# Altium project Gator Stream Receiver.PrjPcb
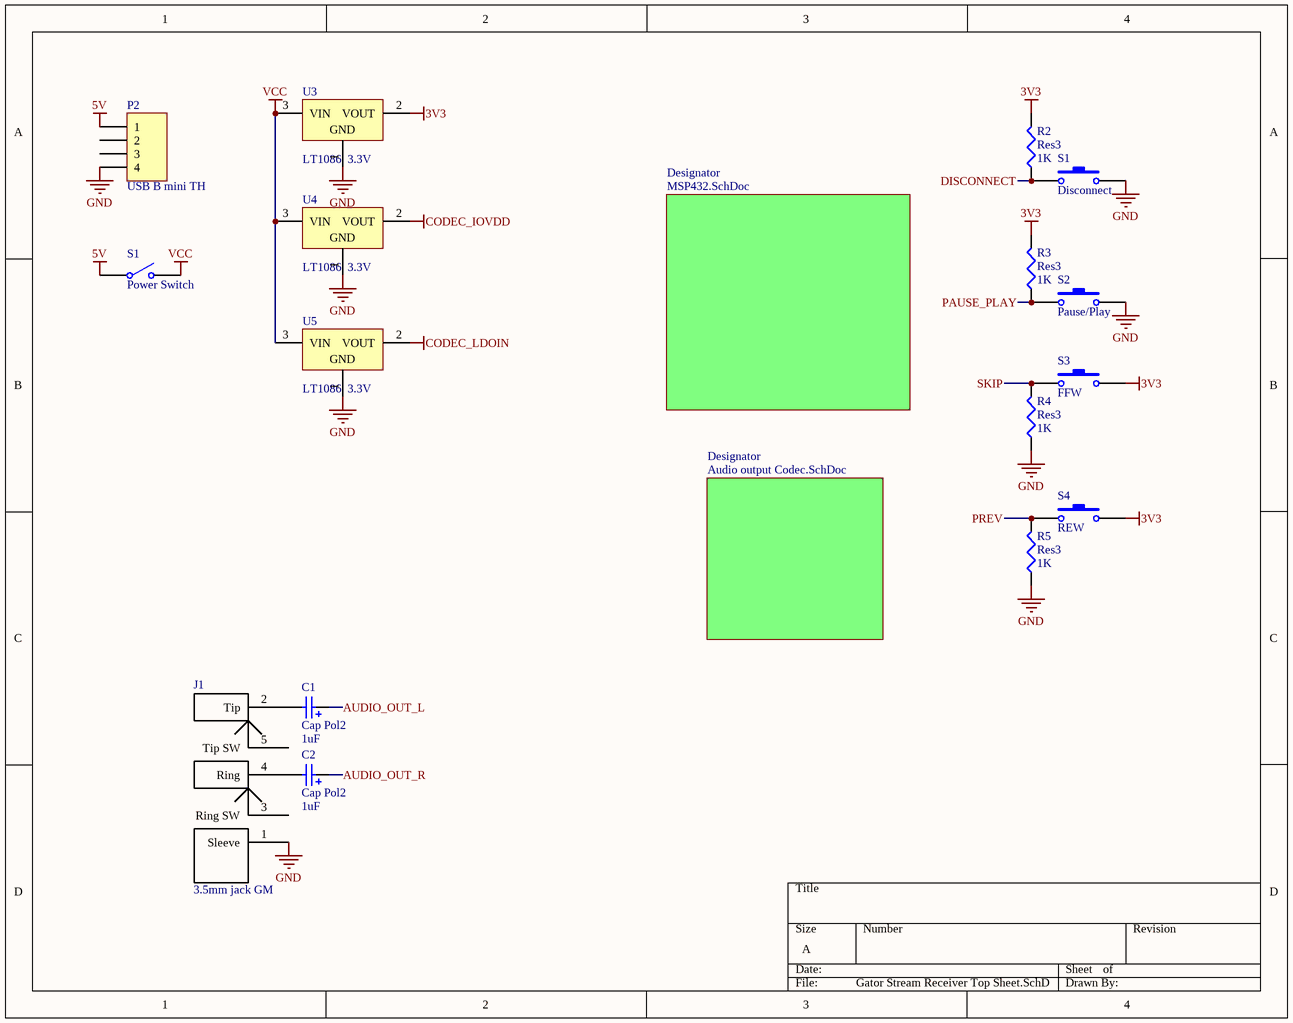
[diagram p0: Gator Stream Receiver Top Sheet.SchDoc]
3 sheets, 36 parts. Net scope: global (net labels, ports and power ports of the same name join across sheets).
Board file: Gator Stream Receiver.PcbDoc
Sheets:
  Gator Stream Receiver Top Sheet.SchDoc
    Designator = Audio output Codec.SchDoc
    Designator = MSP432.SchDoc

## Sheet Gator Stream Receiver Top Sheet.SchDoc
size A

### Parts
(Parts that share a designator on the sheet are numbered #1, #2 ... from top to bottom, then left to right.)
C1  Cap Pol2  value 1uF  [RAD-0.2]
C2  Cap Pol2  value 1uF  [RAD-0.2]
J1  3.5mm jack GM  [3.5mm jack GM]
P2  USB B mini TH  [USB B mini Molex]
R2  Res3  value 1K  [14-1210]
R3  Res3  value 1K  [14-1210]
R4  Res3  value 1K  [14-1210]
R5  Res3  value 1K  [14-1210]
S1#1  Disconnect  [SW PB]
S1#2  Power Switch  [SPST-2]
S2  Pause/Play  [SW PB]
S3  FFW  [SW PB]
S4  REW  [SW PB]
U3  LT1086  3.3V  [TO-220]
U4  LT1086  3.3V  [TO-220]
U5  LT1086  3.3V  [TO-220]

### Sub-sheets
Designator = Audio output Codec.SchDoc: no entries
Designator = MSP432.SchDoc: no entries

### Nets
3V3: R2.2 R3.2 S3.2 S4.2 U3.2(VOUT)
5V: P2.1 S1#2.1(COMMON)
CODEC_IOVDD: U4.2(VOUT)
CODEC_LDOIN: U5.2(VOUT)
GND: J1.1(Sleeve) P2.4 R4.1 R5.1 S1#1.2 S2.2 U3.1(GND) U4.1(GND) U5.1(GND)
VCC: S1#2.2(NO) U3.3(VIN) U4.3(VIN) U5.3(VIN)
AUDIO_OUT_L: C1.1
AUDIO_OUT_R: C2.1
DISCONNECT: R2.1 S1#1.1
PAUSE_PLAY: R3.1 S2.1
PREV: R5.2 S4.1
SKIP: R4.2 S3.1
NetC1_2: C1.2 J1.2(Tip)
NetC2_2: C2.2 J1.4(Ring)

Not connected (* = marked no-connect by the designer): J1 3(Ring_SW) 5(Tip_SW); P2 2 3

### Library data of the parts
C1 C2 = Cap Pol2: Polarized Capacitor (Axial); Published: 8-Jun-2000; LatestRevisionDate: 17-Jul-2002; LatestRevisionNote: Re-released for DXP Platform.; PackageReference: POLAR0.8; Publisher: Altium Limited; PackageDescription: Polarized Capacitor; 2 Leads
R2-R5 = Res3: Resistor; Published: 8-Jun-2000; LatestRevisionDate: 29-May-2009; LatestRevisionNote: IPC-7351 Footprint Added.; PackageReference: J1-0603; Publisher: Altium Limited; PackageDescription: Chip Resistor
S1#1 S2-S4 = SW-PB: DIGIKEY SW400-ND; Published: 24-Mar-1999; LatestRevisionDate: 17-Jul-2002; LatestRevisionNote: Re-released for DXP Platform.; Publisher: Altium Limited
S1#2 = SW-SPST: Single-Pole, Single-Throw Switch; Published: 24-Mar-1999; LatestRevisionDate: 17-Jul-2002; LatestRevisionNote: Re-released for DXP Platform.; PackageReference: SPST-2; Publisher: Altium Limited; PackageDescription: Switch; 2 Leads
P2 = USB B mini TH: LatestRevisionDate: 17-Jul-2002; LatestRevisionNote: Re-released for DXP Platform.; Publisher: Altium Limited; Digikey: WM17115-ND

## Sheet Audio output Codec.SchDoc
size Letter
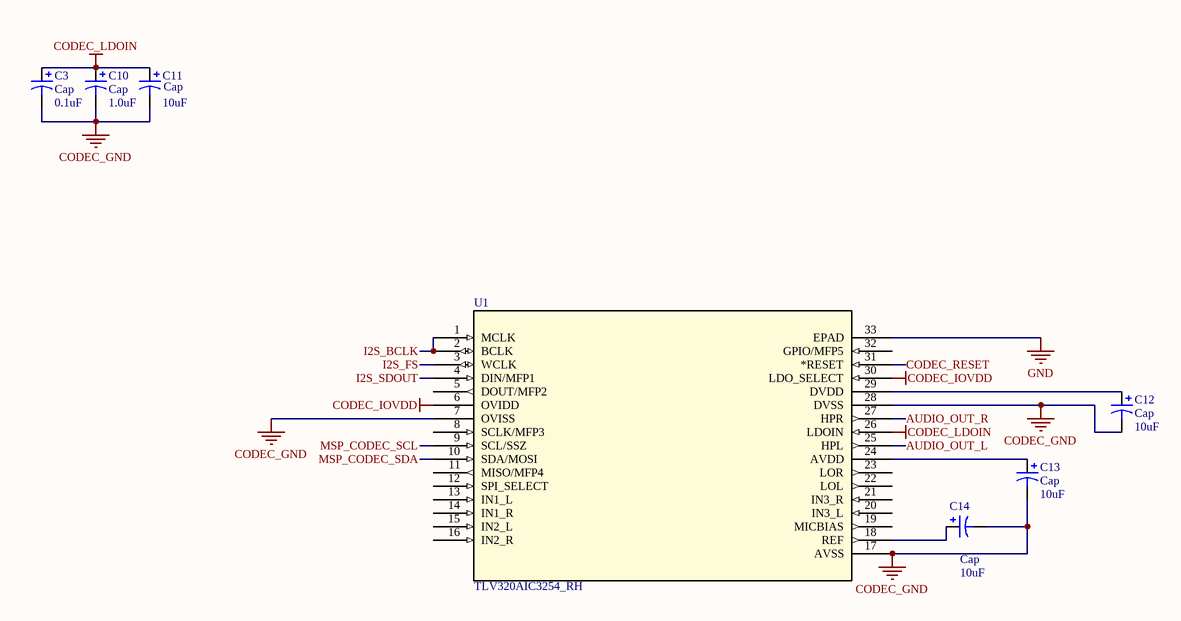
[diagram p1: Audio output Codec.SchDoc]

### Parts
C3  Cap  value 0.1uF  [C0805]
C10  Cap  value 1.0uF  [C0805]
C11  Cap  value 10uF  [C0805]
C12  Cap  value 10uF  [C0805]
C13  Cap  value 10uF  [C0805]
C14  Cap  value 10uF  [C0805]
U1  TLV320AIC3254_RH  [RHB32_3P45X3P45]

### Nets
CODEC_GND: C3.2 C10.2 C11.2 C12.2 C13.2 C14.2 U1.7(OVISS) U1.17(AVSS) U1.28(DVSS)
CODEC_IOVDD: U1.6(OVIDD) U1.30(LDO_SELECT)
CODEC_LDOIN: C3.1 C10.1 C11.1 U1.26(LDOIN)
GND: U1.33(EPAD)
AUDIO_OUT_L: U1.25(HPL)
AUDIO_OUT_R: U1.27(HPR)
CODEC_RESET: U1.31(*RESET)
I2S_BCLK: U1.1(MCLK) U1.2(BCLK)
I2S_FS: U1.3(WCLK)
I2S_SDOUT: U1.4(DIN/MFP1)
MSP_CODEC_SCL: U1.9(SCL/SSZ)
MSP_CODEC_SDA: U1.10(SDA/MOSI)
NetC12_1: C12.1 U1.29(DVDD)
NetC13_1: C13.1 U1.24(AVDD)
NetC14_1: C14.1 U1.18(REF)

Not connected (* = marked no-connect by the designer): U1 5(DOUT/MFP2) 8(SCLK/MFP3) 11(MISO/MFP4) 12(SPI_SELECT) 13(IN1_L) 14(IN1_R) 15(IN2_L) 16(IN2_R) 19(MICBIAS) 20(IN3_L) 21(IN3_R) 22(LOL) 23(LOR) 32(GPIO/MFP5)

### Library data of the parts
C3 C10-C14 = Cap Pol3: Polarized Capacitor (Surface Mount); Published: 8-Jun-2000; LatestRevisionDate: 29-May-2009; LatestRevisionNote: IPC-7351 Footprint Added.; PackageReference: C0805; Publisher: Altium Limited; PackageDescription: Chip Capacitor
U1 = TLV320AIC3254_RH: Imported; Manufacturer_Part_Number: tlv320aic3254_rhb_32; Vendor: Texas Instruments; PACKAGE_DESIGNATOR: RHB; PIN_COUNT: 32; FAMILY_NAME: Audio CODEC; INDUSTRY_STD_PKG_TYPE: QFN; GENERIC_PART_NUMBER: TLV320AIC3254; Manufacturer: Texas Instruments; Datasheet_URL: http://www.ti.com/lit/gpn/TLV320AIC3254; Value: Value; Type: Type; RefDes: RefDes

## Sheet MSP432.SchDoc
size Letter
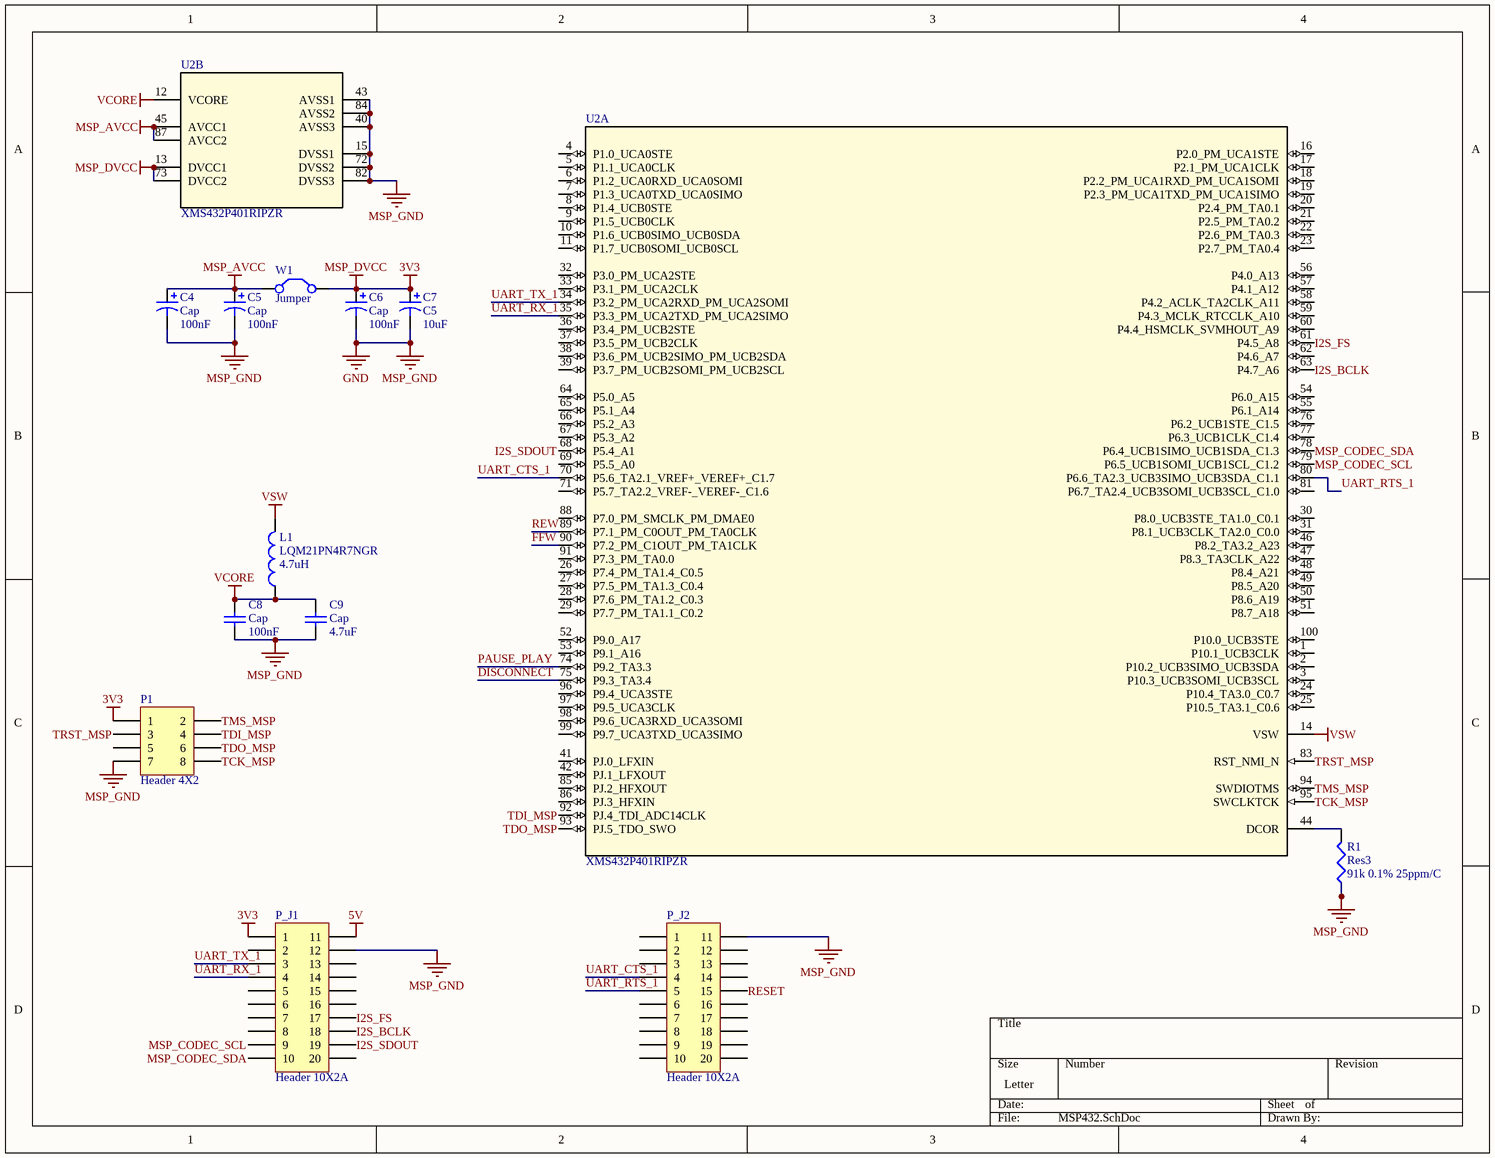
[diagram p2: MSP432.SchDoc]

### Parts
C4  Cap  value 100nF  [C0805]
C5  Cap  value 100nF  [C0805]
C6  Cap  value 100nF  [C0805]
C7  C5  value 10uF  [C0805]
C8  Cap  value 100nF  [C0805]
C9  Cap  value 4.7uF  [C0805]
L1  LQM21PN4R7NGR  value 4.7uH  [6-0805_N]
P1  Header 4X2  [HDR2X4]
P_J1  Header 10X2A  [HDR2X10_CEN]
P_J2  Header 10X2A  [HDR2X10_CEN]
R1  Res3  value 91k 0.1% 25ppm/C  [14-1210]
U2  XMS432P401RIPZR  [PZ0100A_N]  (parts A,B of 2)
W1  Jumper  [RAD-0.2]

### Nets
3V3: C6.1 C7.1 P1.1 P_J1.1 U2.13(DVCC1) U2.73(DVCC2) W1.2(C2)  [also labelled MSP_DVCC]
5V: P_J1.11
GND: C4.2 C5.2 C6.2 C7.2 C8.1 C9.2 P1.7 P_J1.12 P_J2.11 R1.1 U2.15(DVSS1) U2.40(AVSS3) U2.43(AVSS1) U2.72(DVSS2) U2.82(DVSS3) U2.84(AVSS2)  [also labelled MSP_GND]
MSP_AVCC: C4.1 C5.1 U2.45(AVCC1) U2.87(AVCC2) W1.1(C1)
VCORE: C8.2 C9.1 L1.1 U2.12(VCORE)
VSW: L1.2 U2.14(VSW)
DISCONNECT: U2.75(P9.3_TA3.4)
FFW: U2.90(P7.2_PM_C1OUT_PM_TA1CLK)
I2S_BCLK: P_J1.18 U2.63(P4.7_A6)
I2S_FS: P_J1.17 U2.61(P4.5_A8)
I2S_SDOUT: P_J1.19 U2.68(P5.4_A1)
MSP_CODEC_SCL: P_J1.9 U2.79(P6.5_UCB1SOMI_UCB1SCL_C1.2)
MSP_CODEC_SDA: P_J1.10 U2.78(P6.4_UCB1SIMO_UCB1SDA_C1.3)
PAUSE_PLAY: U2.74(P9.2_TA3.3)
RESET: P_J2.15
REW: U2.89(P7.1_PM_C0OUT_PM_TA0CLK)
TCK_MSP: P1.8 U2.95(SWCLKTCK)
TDI_MSP: P1.4 U2.92(PJ.4_TDI_ADC14CLK)
TDO_MSP: P1.6 U2.93(PJ.5_TDO_SWO)
TMS_MSP: P1.2 U2.94(SWDIOTMS)
TRST_MSP: P1.3 U2.83(RST_NMI_N)
UART_CTS_1: P_J2.4 U2.70(P5.6_TA2.1_VREF+_VEREF+_C1.7)
UART_RTS_1: P_J2.5 U2.80(P6.6_TA2.3_UCB3SIMO_UCB3SDA_C1.1)
UART_RX_1: P_J1.4 U2.35(P3.3_PM_UCA2TXD_PM_UCA2SIMO)
UART_TX_1: P_J1.3 U2.34(P3.2_PM_UCA2RXD_PM_UCA2SOMI)
NetR1_2: R1.2 U2.44(DCOR)

Not connected (* = marked no-connect by the designer): P1 5; P_J1 2 5 6 7 8 13 14 15 16 20; P_J2 1 2 3 6 7 8 9 10 12 13 14 16 17 18 19 20; U2 1(P10.1_UCB3CLK) 2(P10.2_UCB3SIMO_UCB3SDA) 3(P10.3_UCB3SOMI_UCB3SCL) 4(P1.0_UCA0STE) 5(P1.1_UCA0CLK) 6(P1.2_UCA0RXD_UCA0SOMI) 7(P1.3_UCA0TXD_UCA0SIMO) 8(P1.4_UCB0STE) 9(P1.5_UCB0CLK) 10(P1.6_UCB0SIMO_UCB0SDA) 11(P1.7_UCB0SOMI_UCB0SCL) 16(P2.0_PM_UCA1STE) 17(P2.1_PM_UCA1CLK) 18(P2.2_PM_UCA1RXD_PM_UCA1SOMI) 19(P2.3_PM_UCA1TXD_PM_UCA1SIMO) 20(P2.4_PM_TA0.1) 21(P2.5_PM_TA0.2) 22(P2.6_PM_TA0.3) 23(P2.7_PM_TA0.4) 24(P10.4_TA3.0_C0.7) 25(P10.5_TA3.1_C0.6) 26(P7.4_PM_TA1.4_C0.5) 27(P7.5_PM_TA1.3_C0.4) 28(P7.6_PM_TA1.2_C0.3) 29(P7.7_PM_TA1.1_C0.2) 30(P8.0_UCB3STE_TA1.0_C0.1) 31(P8.1_UCB3CLK_TA2.0_C0.0) 32(P3.0_PM_UCA2STE) 33(P3.1_PM_UCA2CLK) 36(P3.4_PM_UCB2STE) 37(P3.5_PM_UCB2CLK) 38(P3.6_PM_UCB2SIMO_PM_UCB2SDA) 39(P3.7_PM_UCB2SOMI_PM_UCB2SCL) 41(PJ.0_LFXIN) 42(PJ.1_LFXOUT) 46(P8.2_TA3.2_A23) 47(P8.3_TA3CLK_A22) 48(P8.4_A21) 49(P8.5_A20) 50(P8.6_A19) 51(P8.7_A18) 52(P9.0_A17) 53(P9.1_A16) 54(P6.0_A15) 55(P6.1_A14) 56(P4.0_A13) 57(P4.1_A12) 58(P4.2_ACLK_TA2CLK_A11) 59(P4.3_MCLK_RTCCLK_A10) 60(P4.4_HSMCLK_SVMHOUT_A9) 62(P4.6_A7) 64(P5.0_A5) 65(P5.1_A4) 66(P5.2_A3) 67(P5.3_A2) 69(P5.5_A0) 71(P5.7_TA2.2_VREF-_VEREF-_C1.6) 76(P6.2_UCB1STE_C1.5) 77(P6.3_UCB1CLK_C1.4) 81(P6.7_TA2.4_UCB3SOMI_UCB3SCL_C1.0) 85(PJ.2_HFXOUT) 86(PJ.3_HFXIN) 88(P7.0_PM_SMCLK_PM_DMAE0) 91(P7.3_PM_TA0.0) 96(P9.4_UCA3STE) 97(P9.5_UCA3CLK) 98(P9.6_UCA3RXD_UCA3SOMI) 99(P9.7_UCA3TXD_UCA3SIMO) 100(P10.0_UCB3STE)

### Library data of the parts
C4-C7 = Cap Pol3: Polarized Capacitor (Surface Mount); Published: 8-Jun-2000; LatestRevisionDate: 29-May-2009; LatestRevisionNote: IPC-7351 Footprint Added.; PackageReference: C0805; Publisher: Altium Limited; PackageDescription: Chip Capacitor
C8 C9 = Cap Semi: Capacitor (Semiconductor SIM Model); Published: 8-Jun-2000; LatestRevisionDate: 29-May-2009; LatestRevisionNote: IPC-7351 Footprint Added.; PackageReference: C1206; Publisher: Altium Limited; PackageDescription: Chip Capacitor
L1 = Inductor: Code_IEC: 1005; Published: 8-Jun-2000; LatestRevisionDate: 29-May-2009; LatestRevisionNote: IPC-7351 Footprint Added.; PackageReference: 0402-A; Publisher: Altium Limited; PackageDescription: Chip Inductor; Code_JEITA: 0402
P1 = Header 4X2: Header, 4-Pin, Dual row; LatestRevisionDate: 17-Jul-2002; LatestRevisionNote: Re-released for DXP Platform.; Publisher: Altium Limited
P_J1 P_J2 = Header 10X2A: Header, 10-Pin, Dual row; LatestRevisionDate: 17-Jul-2002; LatestRevisionNote: Re-released for DXP Platform.; Publisher: Altium Limited
R1 = Res3: Resistor; Published: 8-Jun-2000; LatestRevisionDate: 29-May-2009; LatestRevisionNote: IPC-7351 Footprint Added.; PackageReference: J1-0603; Publisher: Altium Limited; PackageDescription: Chip Resistor
U2 = XMS432P401RIPZR: Imported; Manufacturer: Texas Instruments; CompType: IC; PIN_COUNT: 100; PartNumber: XMS432P401RIPZR; PackageReference: PZ0100A; MountType: SMT; RefDes: RefDes; TYPE: TYPE; Value: Value
W1 = Jumper: Jumper Wire; Published: 24-Mar-1999; LatestRevisionDate: 17-Jul-2002; LatestRevisionNote: Re-released for DXP Platform.; PackageReference: RAD-0.2; Publisher: Altium Limited; PackageDescription: Radial Cap, Thru-Hole; 2 Leads; 0.2 in Pin Spacing

## Nets that join several sheets
3V3: Gator Stream Receiver Top Sheet (5 pins), MSP432 (7 pins)
5V: Gator Stream Receiver Top Sheet (P2.1 S1#2.1), MSP432 (P_J1.11)
CODEC_IOVDD: Gator Stream Receiver Top Sheet (U4.2), Audio output Codec (U1.6 U1.30)
CODEC_LDOIN: Gator Stream Receiver Top Sheet (U5.2), Audio output Codec (C3.1 C10.1 C11.1 U1.26)
GND: Gator Stream Receiver Top Sheet (9 pins), Audio output Codec (U1.33), MSP432 (16 pins)
AUDIO_OUT_L: Gator Stream Receiver Top Sheet (C1.1), Audio output Codec (U1.25)
AUDIO_OUT_R: Gator Stream Receiver Top Sheet (C2.1), Audio output Codec (U1.27)
DISCONNECT: Gator Stream Receiver Top Sheet (R2.1 S1#1.1), MSP432 (U2.75)
I2S_BCLK: Audio output Codec (U1.1 U1.2), MSP432 (P_J1.18 U2.63)
I2S_FS: Audio output Codec (U1.3), MSP432 (P_J1.17 U2.61)
I2S_SDOUT: Audio output Codec (U1.4), MSP432 (P_J1.19 U2.68)
MSP_CODEC_SCL: Audio output Codec (U1.9), MSP432 (P_J1.9 U2.79)
MSP_CODEC_SDA: Audio output Codec (U1.10), MSP432 (P_J1.10 U2.78)
PAUSE_PLAY: Gator Stream Receiver Top Sheet (R3.1 S2.1), MSP432 (U2.74)